# EAGLE design INS_iter5 (EAGLE 9.4.2)
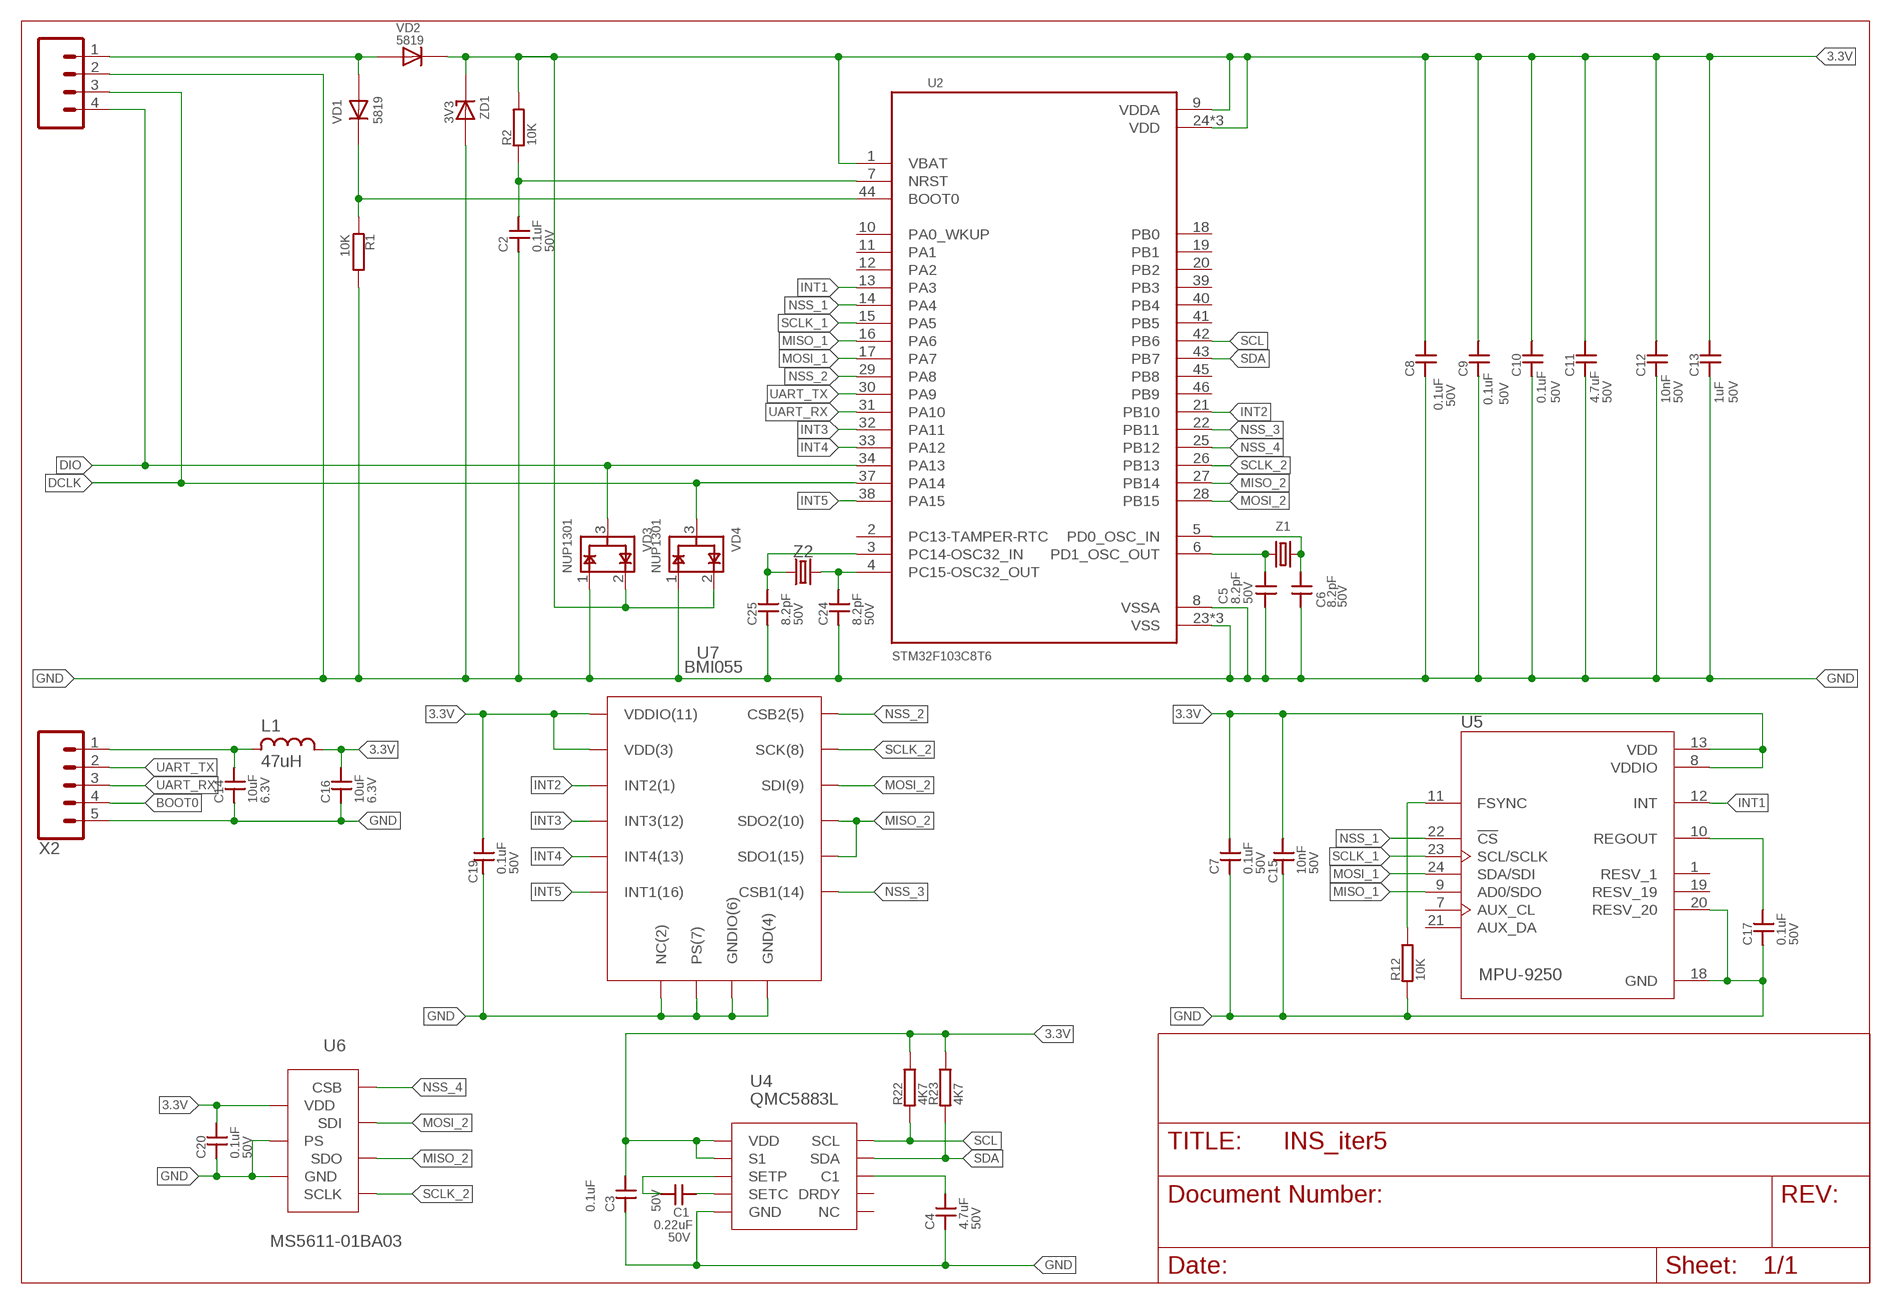
[diagram p0: schematic, sheet 1]

## Parts
C1  0.22uF  C0402  [0402]
C2  0.1uF  C0402  [0402]
C3  0.1uF  C0402  [0402]
C4  4.7uF  C0402  [0402]
C5  8.2pF  C0402  [0402]
C6  8.2pF  C0402  [0402]
C7  0.1uF  C0402  [0402]
C8  0.1uF  C0402  [0402]
C9  0.1uF  C0402  [0402]
C10  0.1uF  C0402  [0402]
C11  4.7uF  C0402  [0402]
C12  10nF  C0402  [0402]
C13  1uF  C0402  [0402]
C14  10uF  C0402  [0402]
C15  10nF  C0402  [0402]
C16  10uF  C0402  [0402]
C17  0.1uF  C0402  [0402]
C19  0.1uF  C0402  [0402]
C20  0.1uF  C0402  [0402]
C24  8.2pF  C0402  [0402]
C25  8.2pF  C0402  [0402]
L1  47uH  L0603_SMALL  [0603_SMALL]
R1  10K  R0402  [0402]
R2  10K  R0402  [0402]
R12  10K  R0402  [0402]
R22  4K7  R0402  [0402]
R23  4K7  R0402  [0402]
U2  STM32F103C8T6  [QFP50P900X900X160-48N]
U4  QMC5883L  [QFN16(3X3)NOPAD]
U5  MPU-9250  [QFN40P300X300X105-24N]
U6  MS5611-01BA03  [QFN5X3]
U7  BMI055  [LGA16PIN]
VD1  5819  DIODE0402  [0402]
VD2  5819  DIODE0402  [0402]
VD3  NUP1301  ESD_PROTECTIONSOT123  [SOT23]
VD4  NUP1301  ESD_PROTECTIONSOT123  [SOT23]
X1  1X4DUPON  1X4DUPON_2MM  [1X04DUPON_2MM]
X2  1X5FFC5-1MM  [FFC-1MM_5]
Z1  8MHz  CRYSTAL4FOOT  [CRYSTAL-SMD-3.2X2.5MM]
Z2  CRYSTAL2FOOT  [CRYSTAL-SMD-3.2X1.5X90MM]
ZD1  3V3  ZENER-DIODES  [SOD-323]

## Nets
3.3V: C3.2 C7.2 C8.2 C9.2 C10.2 C11.2 C12.2 C13.2 C15.2 C16.2 C19.2 C20.2 L1.P$2 R2.2 R22.2 R23.2 U2.1(VBAT) U2.9(VDDA) U2.24(VDD) U2.36(VDD) U2.48(VDD) U4.2(VDD) U4.4(S1) U4.13(VDD) U5.8(VDDIO) U5.13(VDD) U6.P$4(VDD) U7.P$3(VDD(3)) U7.P$11(VDDIO(11)) VD2.1(C) VD3.2(VCC) VD4.2(VCC) ZD1.2(C)
3.3V_S: VD1.2(A) VD2.2(A) X1.1
BOOT0: R1.1 U2.44(BOOT0) VD1.1(C) X2.4
DCLK: U2.37(PA14) VD4.3(I/O) X1.3
DIO: U2.34(PA13) VD3.3(I/O) X1.4
GND: C2.1 C3.1 C4.1 C5.1 C6.1 C7.1 C8.1 C9.1 C10.1 C11.1 C12.1 C13.1 C14.1 C15.1 C16.1 C17.1 C19.1 C20.1 C24.1 C25.1 R1.2 R12.1 U2.8(VSSA) U2.23(VSS) U2.35(VSS) U2.47(VSS) U4.9(GND) U4.11(GND) U5.18(GND) U5.20(RESV_20) U6.P$2(GND) U6.P$3(PS) U7.P$2(NC(2)) U7.P$4(GND(4)) U7.P$6(GNDIO(6)) U7.P$7(PS(7)) VD3.1(GND) VD4.1(GND) X1.2 X2.5 ZD1.1(A)
INT1: U2.13(PA3) U5.12(INT)
INT2: U2.21(PB10) U7.P$1(INT2(1))
INT3: U2.32(PA11) U7.P$12(INT3(12))
INT4: U2.33(PA12) U7.P$13(INT4(13))
INT5: U2.38(PA15) U7.P$16(INT1(16))
MISO_1: U2.16(PA6) U5.9(AD0/SDO)
MISO_2: U2.27(PB14) U6.P$7(SDO) U7.P$10(SDO2(10)) U7.P$15(SDO1(15))
MOSI_1: U2.17(PA7) U5.24(SDA/SDI)
MOSI_2: U2.28(PB15) U6.P$6(SDI) U7.P$9(SDI(9))
N$2: C25.2 U2.3(PC14-OSC32_IN) Z2.P$1
N$3: C2.2 R2.1 U2.7(NRST)
N$4: C24.2 U2.4(PC15-OSC32_OUT) Z2.P$2
N$5: C17.2 U5.10(REGOUT)
N$6: R12.2 U5.11(FSYNC)
N$9: C14.2 L1.P$1 X2.1
N$16: C5.2 U2.6(PD1_OSC_OUT) Z1.1
N$17: C6.2 U2.5(PD0_OSC_IN) Z1.3
N$22: C1.2 U4.12(SETC)
N$25: C1.1 U4.8(SETP)
N$28: C4.2 U4.10(C1)
NSS_1: U2.14(PA4) U5.22(!CS)
NSS_2: U2.29(PA8) U7.P$5(CSB2(5))
NSS_3: U2.22(PB11) U7.P$14(CSB1(14))
NSS_4: U2.25(PB12) U6.P$1(CSB) U6.P$8(CSB)
SCL: R22.1 U2.42(PB6) U4.1(SCL)
SCLK_1: U2.15(PA5) U5.23(SCL/SCLK)
SCLK_2: U2.26(PB13) U6.P$5(SCLK) U7.P$8(SCK(8))
SDA: R23.1 U2.43(PB7) U4.16(SDA)
UART_RX: U2.31(PA10) X2.3
UART_TX: U2.30(PA9) X2.2
Unconnected: U2.2(PC13-TAMPER-RTC) U2.10(PA0_WKUP) U2.11(PA1) U2.12(PA2) U2.18(PB0) U2.19(PB1) U2.20(PB2) U2.39(PB3) U2.40(PB4) U2.41(PB5) U2.45(PB8) U2.46(PB9) U4.3(NC) U4.5(NC) U4.6(NC) U4.7(NC) U4.14(NC) U4.15(DRDY) U5.1(RESV_1) U5.7(AUX_CL) U5.19(RESV_19) U5.21(AUX_DA)

## Library data of the parts
C1-C13 C15 C17 C19 C20 C24 C25 = LARS_409_R,C,L:C; VOLTAGE: 50V
C14 C16 = LARS_409_R,C,L:C; VOLTAGE: 6.3V
L1 = LARS_409_R,C,L:L
R1 R2 R12 R22 R23 = LARS_409_R,C,L:R
U2 = LARS_409_MK:STM32F103C8T6
U4 = LARS_409_MC:QMC5883L
U5 = LARS_409_SENSORS:MPU-9250: Axis=3 Axis Gyro+3 Axis Accel+Compass. Pin For Pin With m Check prices <https://pricing.snapeda.com/parts/MPU-9250/TDK%20InvenSense/view-part?ref=eda>; AVAILABILITY: Bad; DESCRIPTION: Accelerometer, Gyroscope, Magnetometer, 9 Axis Sensor I²C, SPI Output; MF: TDK InvenSense; MP: MPU-9250; PACKAGE: TFQFN-24 TDK InvenSense; PRICE: None
U6 = LARS_409_SENSORS:MS5611-01BA03
U7 = LARS_409_SENSORS:BMI055
VD1 VD2 = LARS_409_DIODE:DIODE
VD3 VD4 = LARS_409_DIODE:ESD_PROTECTION
X1 = LARS_409_CONNECTORS:1X4
X2 = LARS_409_CONNECTORS:1X5
Z1 Z2 = LARS_409_CLOCKS:CRYSTAL
ZD1 = LARS_409_DIODE:ZENER-DIODES

## Board
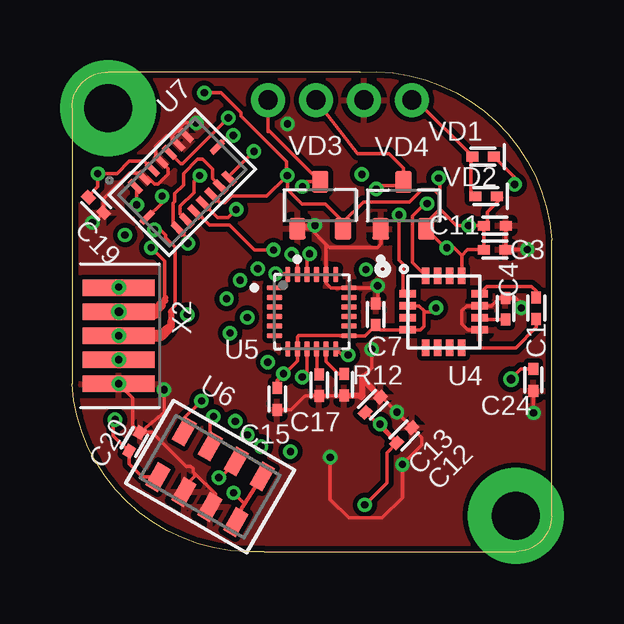
[diagram p1: board, top side]
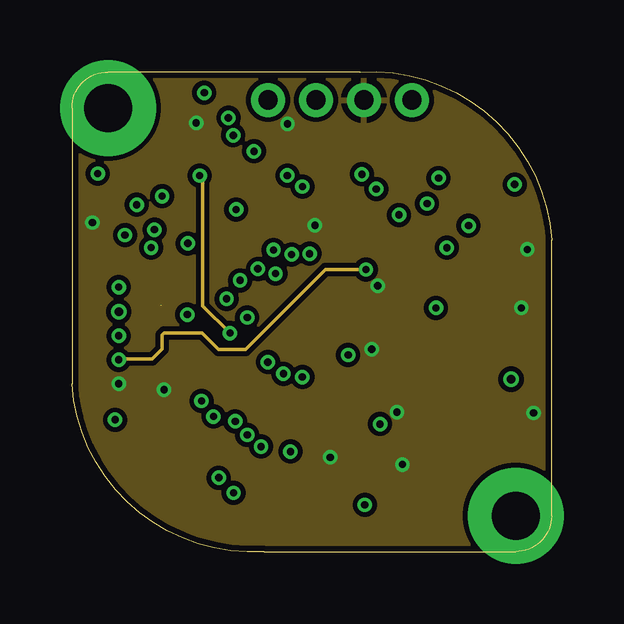
[diagram p2: board, inner layer Route2]
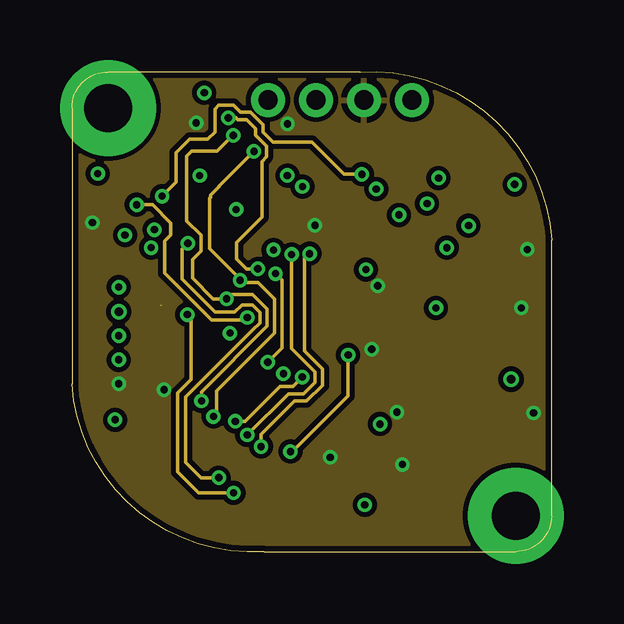
[diagram p3: board, inner layer Route15]
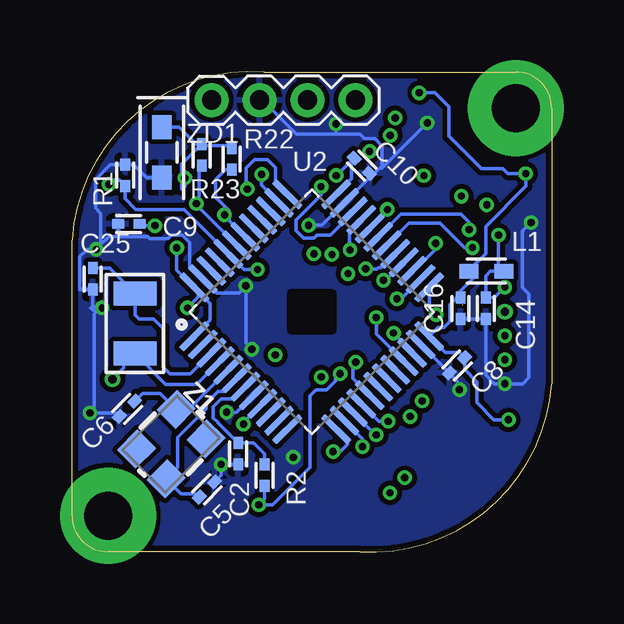
[diagram p4: board, bottom side, seen from below]

Size 20 x 20.03 mm. Coordinates in mm from the lower left corner, seen from the top.
Outline: 8,0.01 18.5,0.01 arc90 20,1.51 20,13.01 arc90 12,20.01 1.5,20.01 arc90 0,18.51 0,7.01 arc90 8,0.01
Copper layers (1*2*15*16): Top 0.035mm / dielectric 1.6mm / Route2 0.035mm / dielectric 0.15mm / Route15 0.035mm / dielectric 0.2mm / Bottom 0.035mm
Design rules "pcbWAY4layers": minimum track width 6mil, minimum drill 0.3mm, track to track 6mil, track to pad 6mil, pad to pad 6mil, via to via 6mil, smd to smd 0mil, copper to edge 0.25mm, drill to drill 0.25mm, minimum pad ring 0.15mm, minimum via ring 0.15mm, stop-mask expansion 2mil, vias tented up to drill 3mm, thermal gap 10mil

### Footprints (pad centres in the part's own frame; a part is rotated, then mirrored left to right if it is on the bottom)
0402 = smd 0.5 x 0.4: 1 -0.45,0; 2 0.45,0
0603_SMALL = smd 0.8 x 0.6: P$1 -0.727,0; P$2 0.727,0
QFP50P900X900X160-48N = smd 1.56 x 0.28: 1 -4.18,2.75; 2 -4.18,2.25; 3 -4.18,1.75; 4 -4.18,1.25; 5 -4.18,0.75; 6 -4.18,0.25; 7 -4.18,-0.25; 8 -4.18,-0.75; 9 -4.18,-1.25; 10 -4.18,-1.75; 11 -4.18,-2.25; 12 -4.18,-2.75; 25 4.18,-2.75; 26 4.18,-2.25; 27 4.18,-1.75; 28 4.18,-1.25; 29 4.18,-0.75; 30 4.18,-0.25; 31 4.18,0.25; 32 4.18,0.75; 33 4.18,1.25; 34 4.18,1.75; 35 4.18,2.25; 36 4.18,2.75 | smd 0.28 x 1.56: 13 -2.75,-4.18; 14 -2.25,-4.18; 15 -1.75,-4.18; 16 -1.25,-4.18; 17 -0.75,-4.18; 18 -0.25,-4.18; 19 0.25,-4.18; 20 0.75,-4.18; 21 1.25,-4.18; 22 1.75,-4.18; 23 2.25,-4.18; 24 2.75,-4.18; 37 2.75,4.18; 38 2.25,4.18; 39 1.75,4.18; 40 1.25,4.18; 41 0.75,4.18; 42 0.25,4.18; 43 -0.25,4.18; 44 -0.75,4.18; 45 -1.25,4.18; 46 -1.75,4.18; 47 -2.25,4.18; 48 -2.75,4.18
QFN16(3X3)NOPAD = smd 0.7 x 0.3: 1 -1.5,0.75; 2 -1.5,0.25; 3 -1.5,-0.25; 4 -1.5,-0.75; 9 1.5,-0.75; 10 1.5,-0.25; 11 1.5,0.25; 12 1.5,0.75 | smd 0.3 x 0.7: 5 -0.75,-1.5; 6 -0.25,-1.5; 7 0.25,-1.5; 8 0.75,-1.5; 13 0.75,1.5; 14 0.25,1.5; 15 -0.25,1.5; 16 -0.75,1.5
QFN40P300X300X105-24N = smd 0.64 x 0.22: 1 -1.545,1; 2 -1.545,0.6; 3 -1.545,0.2; 4 -1.545,-0.2; 5 -1.545,-0.6; 6 -1.545,-1; 13 1.545,-1; 14 1.545,-0.6; 15 1.545,-0.2; 16 1.545,0.2; 17 1.545,0.6; 18 1.545,1 | smd 0.22 x 0.64: 7 -1,-1.545; 8 -0.6,-1.545; 9 -0.2,-1.545; 10 0.2,-1.545; 11 0.6,-1.545; 12 1,-1.545; 19 1,1.545; 20 0.6,1.545; 21 0.2,1.545; 22 -0.2,1.545; 23 -0.6,1.545; 24 -1,1.545
QFN5X3 = smd 1.1 x 0.6: P$1 -1.1,-1.875; P$2 -1.1,-0.625; P$3 -1.1,0.625; P$4 -1.1,1.875; P$5 1.1,1.875; P$6 1.1,0.625; P$7 1.1,-0.625; P$8 1.1,-1.875
LGA16PIN = smd 0.675 x 0.25: P$1 -1.262,-1.5; P$2 -1.262,-1; P$3 -1.262,-0.5; P$4 -1.262,0; P$5 -1.262,0.5; P$6 -1.262,1; P$7 -1.262,1.5; P$9 1.262,1.5; P$10 1.262,1; P$11 1.262,0.5; P$12 1.262,0; P$13 1.262,-0.5; P$14 1.262,-1; P$15 1.262,-1.5 | smd 0.25 x 0.675: P$8 0,2.072; P$16 0,-2.072
SOT23 = smd 0.7 x 0.9: 1 -0.95,-0.98; 2 0.95,-0.98; 3 0,0.98
1X04DUPON_2MM = drill 0.8 pad 1.422: 1 0,0; 2 2,0; 3 4,0; 4 6,0
FFC-1MM_5 = smd 0.7 x 3: 1 -2,0; 2 -1,0; 3 0,0; 4 1,0; 5 2,0
CRYSTAL-SMD-3.2X2.5MM = smd 1.2 x 1.1: 1 -1.159,-0.843; 2 1.191,-0.843; 3 1.191,0.907; 4 -1.159,0.907
CRYSTAL-SMD-3.2X1.5X90MM = smd 1 x 1.8: P$1 -1.25,0; P$2 1.25,0
SOD-323 = smd 1 x 0.8: 1 -1.062,0; 2 1.042,0

### Placement (x,y rotation side)
C1  19.36,10.16 90 top
C2  13.07,4.1 90 bottom
C3  17.63,12.6 180 top
C4  18.08,10.14 270 top
C5  14.37,2.6 225 bottom
C6  17.7,5.97 45 bottom
C7  12.67,9.91 270 top
C8  3.94,7.78 45 bottom
C9  17.63,13.67 0 bottom
C10  7.92,16.1 135 bottom
C11  17.64,13.6 180 top
C12  13.86,4.86 225 top
C13  12.55,6.14 225 top
C14  2.74,10.15 90 bottom
C15  8.56,6.38 90 top
C16  3.8,10.15 90 bottom
C17  10.31,6.96 90 top
C19  1.01,14.46 135 top
C20  2.61,4.59 240 top
C24  19.24,7.17 90 top
C25  19.13,11.38 90 bottom
L1  2.72,11.7 180 bottom
R1  17.78,15.71 90 bottom
R2  11.97,3.2 270 bottom
R12  11.35,6.98 90 top
R22  13.34,16.38 90 bottom
R23  14.59,16.55 90 bottom
U2  10,10.01 45 bottom
U4  15.5,10.01 0 top
U5  10,10.01 0 top
U6  5.76,3.13 60 top
U7  4.6,15.41 315 top
VD1  17.14,16.48 180 top
VD2  17.27,14.83 180 top
VD3  10.35,14.45 0 top
VD4  13.82,14.44 0 top
X1  14.18,18.84 0 bottom
X2  1.95,9.01 270 top
Z1  15.85,4.46 45 bottom
Z2  17.37,9.52 270 bottom
ZD1  16.25,16.67 90 bottom

### Tracks (layer width: path | path; a pad name or v marks a point on that pad's centre or on a via)
3.3V  (via drill 0.3)
  Top 0.152: U4.13 16.25,12.36 | 16.25,12.36 16.49,12.6 C3.2 C11.2 | 14.67,10.01 14.67,9.39 14.54,9.26 U4.4 12.86,9.26 C7.2 12.23,9.01 U5.13 11.19,9.01 11.19,9.02 9.45,9.02 9.4,8.96 U5.8 9.4,7.96 8.56,7.12 C15.2 8.56,7.16 v8.82,7.42 v8.82,7.43 | 14.67,10.01 14.67,10.06 14.47,10.26 U4.2 | U6.P$4 2.92,3.12 2.38,3.67 C20.2 1.72,4.84 1.72,5.43 v1.8,5.51 | 16.25,12.36 15.93,12.68 v15.63,12.68 15.55,12.68 VD4.2 14.78,13.74 15.34,14.31 | C12.2 12.27,5.82 C13.2 | 14.67,10.01 15.02,10.01 v15.18,10.17 | C12.2 13.13,4.14 13.13,2.88 v12.21,1.96 | C19.2 0.69,14.83 1.08,15.22 v1.08,15.77 1.88,15.77 2.4,16.29 3.02,16.29 U7.P$3 | v12.85,5.33 13.54,4.64 C12.2 | 11.3,13.74 11.3,13.77 10.58,14.49 9.6,14.49 8.98,15.11 v8.98,15.69 8.95,15.66 | 11.3,13.74 VD3.2 | 11.3,13.74 12.15,14.59 14.07,14.59 14.59,15.11 15.09,15.11 15.34,14.86 | 15.34,14.31 15.34,14.86 | v15.29,15.59 15.34,15.54 15.34,14.86 | C11.2 v16.54,13.6 16.04,13.6 15.34,14.31 | C11.2 17.32,13.74 17.32,14.17 17.92,14.78 VD2.1 | U7.P$11 6.16,14.56 6.38,14.56 6.66,14.84 8.12,14.84 8.95,15.66 | v5.52,19.14 6.23,19.14 7.05,18.32 7.05,18.16 8.95,16.27 8.95,15.66
  Bottom 0.152: R23.2 14.53,16.94 13.45,16.94 R22.2 | v15.63,12.68 15.63,11.76 U2.48 14.73,10.86 | U2.36 8.34,15.56 8.34,16.32 C10.2 8.96,15.69 v8.98,15.69 | U2.1 14.23,9.67 14.23,10.36 14.73,10.86 | v15.18,10.17 14.73,10.62 14.73,10.86 | R2.2 11.97,2.2 v12.21,1.96 11.63,1.96 10.07,3.52 10.07,6.51 9.81,6.76 9.38,6.76 9.02,7.12 9.02,7.36 8.95,7.43 v8.82,7.43 | U2.9 12.85,5.4 v12.85,5.33 | R23.2 15.42,16.16 15.42,15.12 15.29,15.26 v15.29,15.59 | R23.2 14.83,17 15.54,17.71 ZD1.2 | C9.2 17.11,13.6 v16.54,13.6 | v1.8,5.51 2.4,5.51 3.11,6.22 3.11,7.09 3.62,7.61 C8.2 3.85,8.32 4.42,8.32 U2.24 4.74,9.37 4.49,9.37 4.24,9.62 4.24,10.31 3.95,10.6 C16.2 3.8,10.87 3.21,11.47 L1.P$2 3.45,11.74 2.75,12.44 2.75,13.58 1.08,15.24 v1.08,15.77 1.82,15.77 2.03,15.99 2.92,15.99 4.27,17.34 4.27,18.56 4.86,19.14 v5.52,19.14
3.3V_S
  Top 0.152: X1.1 14.34,18.84 VD1.2 16.64,16.43 16.64,15.01 VD2.2
BOOT0  (via drill 0.3)
  Top 0.152: VD1.1 18.46,15.61 v18.46,15.32
  Route2 0.152: v12.26,11.77 10.58,11.77 7.24,8.43 6.12,8.43 5.43,9.12 3.84,9.12 3.77,9.05 3.77,8.46 3.35,8.04 1.98,8.04 X2.4
  Bottom 0.152: v12.26,11.77 12.82,11.77 U2.44 15.33,14.28 17.34,14.28 17.78,14.72 R1.1 18.02,15.49 18.29,15.49 v18.46,15.32
  other vias: 1.95,8.01
DCLK  (via drill 0.3)
  Top 0.152: X1.3 11.91,16.61 13.21,16.61 13.82,16 VD4.3 13.68,15.27 12.83,15.27 v12.69,15.13
  Bottom 0.152: v12.69,15.13 12.69,15.41 12.74,15.36 12.74,16 12.39,16.35 11.84,16.35 11.51,16.02 11.51,15.41 U2.37
DIO  (via drill 0.3)
  Top 0.152: X1.4 8.18,17.53 8.21,17.58 VD3.3 9.81,15.43 v9.61,15.23
  Bottom 0.152: U2.34 8.28,14.17 9.23,13.22 9.78,13.22 9.91,13.09 10.35,13.09 10.66,13.4 10.66,13.84 9.61,14.89 v9.61,15.23
GND  (via drill 0.3)
  Top 0.152: C7.1 12.75,10.44 v12.75,11.09 12.67,11.01 U5.18 10.81,11.01 10.6,11.22 U5.20 10.6,12.82 | U4.9 16.5,9.26 16.27,9.49 16.27,10.07 16.46,10.26 U4.11 17.49,10.26 17.82,10.59 C4.1 18.52,10.59 18.74,10.37 v18.74,10.17 | 10.6,12.82 9.95,13.47 VD3.1 9.55,13.62 v10.13,13.62 | v3.84,6.76 3.84,5.81 C20.1 | C20.1 2.54,5.28 2.54,6.42 X2.5 | 12.87,6.56 C13.1 12.92,6.46 v13.55,5.83 13.55,5.81 C12.1 14.6,4.76 14.6,4.47 v13.78,3.65 13.78,2.26 12.93,1.41 11.55,1.41 10.77,2.19 v10.77,3.94 | 11.38,6.56 R12.1 11.33,6.51 C17.1 9.72,6.51 9.14,5.93 C15.1 | v0.85,13.73 0.91,13.73 C19.1 1.32,14.73 2.4,15.8 2.8,15.8 U7.P$2 3.19,15.6 3.45,15.34 3.58,15.34 4.01,15.76 4.01,15.99 U7.P$4 3.49,16.52 3.49,16.91 3.94,17.36 4.18,17.36 | 10.6,12.82 10.74,12.68 12.73,12.68 12.88,12.83 VD4.1 | C11.1 C3.1 18.09,12.61 v18.99,12.61 | 12.12,7.3 12.5,7.68 v12.5,8.45 | C20.1 3.34,4.98 4.75,3.57 4.95,3.57 5.05,3.47 5.05,3.34 | U6.P$3 4.67,2.7 5.12,3.16 5.12,3.27 5.98,2.41 5.98,2.1 U6.P$2 | U7.P$6 4.18,17.25 4.18,17.36 | 4.18,17.36 4.37,17.55 | U7.P$7 4.58,17.55 4.37,17.55 | 4.37,17.55 4.71,17.89 v5.18,17.89 | C24.1 v19.24,5.8 v19.25,5.79
  Top 0.254: R12.1 11.99,6.53 12.06,6.45 12.12,6.52 12.12,7.08 | 12.12,7.08 12.12,7.3 | C13.1 12.24,7.08 12.12,7.08
  Bottom 0.152: C2.1 v13.78,3.65 13.78,3.2 C5.1 | U2.23 C8.1 4.09,7.29 4.09,7.26 3.84,7.01 v3.84,6.76 | C16.1 C14.1 2.74,7.37 2.38,7.01 X2.5 1.2,7.01 0.94,7.27 0.94,10.75 1.21,11.02 1.21,13.37 v0.85,13.73 | U2.8 13.03,5.92 13.05,5.92 13.14,5.83 v13.55,5.83 | C6.1 18.16,5.79 v19.25,5.79 19.07,5.97 19.07,9.91 18.81,10.17 | v18.74,10.17 18.81,10.17 | 18.81,10.17 19.22,10.17 19.14,10.09 18.95,10.09 19.13,10.27 C25.1 19.67,10.93 19.67,12.31 19.37,12.61 v18.99,12.61 18.8,12.81 | v12.5,8.45 12.75,8.7 v12.75,11.09 13.04,10.8 13.97,10.8 U2.47 15.1,11.93 15.1,12.9 15.41,13.21 15.85,13.21 15.99,13.08 16.76,13.08 16.84,13.15 18.19,13.15 | 18.8,12.81 18.45,13.15 18.19,13.15 | 7.08,16.09 7.38,15.79 C10.1 7.6,15.6 U2.35 9.58,13.62 v10.13,13.62 | v5.18,17.89 7.08,16 7.08,16.09 | X1.2 12.11,18.89 10.64,17.42 9,17.42 | 9,17.42 7.99,17.42 7.8,17.23 7.37,17.23 7.06,16.92 7.06,16.48 7.08,16.47 7.08,16.09 | 18.19,13.15 18.08,13.27 C9.1 | 18.8,12.81 18.8,14.11 19.02,14.33 19.02,15.53 18.4,16.16 R1.2 17.43,16.16 16.88,15.61 ZD1.1 | 9,17.42 8.99,17.43 v8.99,17.84
  other vias: 1.95,7.01
  pour Top (isolate 0.2): -1,-0.99 21,-0.99 21,21.01 -1,21.01
  pour Route2 (isolate 0.2): -2,-1.99 22,-1.99 22,2.01 22,22.01 18,22.01 -2,22.01
  pour Route15 (isolate 0.2): -3,-2.99 23,-2.99 23,1.01 23,23.01 17,23.01 -3,23.01
  pour Bottom (isolate 0.2): -4,-3.99 24,-3.99 24,1.01 24,24.01 19,24.01 -4,24.01
INT1  (via drill 0.3)
  Top 0.152: U5.12 11.26,8.21 v11.52,8.21
  Route15 0.152: v11.52,8.21 11.52,6.51 9.19,4.18 v9.11,4.18
  Bottom 0.152: U2.13 8.51,4.63 8.51,4.49 8.81,4.18 v9.11,4.18
INT2  (via drill 0.3)
  Top 0.152: v2.7,14.47 2.7,15.19 U7.P$1
  Route15 0.152: v7.31,9.77 7.21,9.67 5.82,9.67 3.86,11.63 3.86,12.96 4.12,13.22 4.12,13.71 3.36,14.47 v2.7,14.47
  Bottom 0.152: U2.21 7.31,9.09 v7.31,9.77
INT3  (via drill 0.3)
  Top 0.152: U7.P$12 6.08,13.94 6.51,13.94 v6.85,14.28
  Bottom 0.152: U2.32 6.84,14.24 v6.84,14.27 v6.85,14.28
INT4  (via drill 0.3)
  Top 0.152: v8.41,12.59 7.61,12.59 6.57,13.63 5.73,13.63 5.2,14.17 U7.P$13
  Bottom 0.152: v8.41,12.59 8.41,12.91 8.43,12.92 8.43,13.36 U2.33
INT5  (via drill 0.3)
  Top 0.152: v3.76,14.83 3.75,14.54 U7.P$16
  Route15 0.152: v3.76,14.83 4.35,15.42 4.35,16.65 4.9,17.2 5.65,17.2 5.96,17.51 5.96,18.46 6.12,18.63 6.74,18.63 7.04,18.33 7.45,18.33 7.96,17.82 7.96,17.51 8.39,17.08 10,17.08 11.34,15.74 v12.09,15.74
  Bottom 0.152: v12.09,15.74 12.09,15.29 U2.38
MISO_1  (via drill 0.3)
  Top 0.152: U5.9 9.8,7.48 v9.61,7.29
  Route15 0.152: v6.81,5.44 7.22,5.44 8.67,6.9 9.21,6.9 v9.61,7.29
  Bottom 0.152: U2.16 7.2,5.44 v6.81,5.44
MISO_2  (via drill 0.3)
  Top 0.152: v4.83,12.87 4.78,12.92 4.78,13.11 U7.P$15 4.21,13.68 4.21,14.54 4.29,14.62 4.29,14.93 4.65,15.29 4.65,15.78 5.24,16.37 5.45,16.37 5.86,15.97 5.86,15.57 U7.P$10 | U6.P$7 6.17,3.09 v6.12,3.09
  Route15 0.152: v6.12,3.09 5.38,3.09 4.74,3.74 4.74,6.46 7.52,9.25 7.53,9.25 7.84,9.56 7.84,9.99 7.53,10.3 7.09,10.3 6.79,10 5.98,10 4.59,11.38 4.59,12.62 v4.83,12.87
  Bottom 0.152: U2.27 5.73,11.73 4.74,12.72 4.74,12.77 v4.83,12.87
MOSI_1  (via drill 0.3)
  Top 0.152: v8.49,11.6 8.96,11.6 U5.24
  Route15 0.152: v8.49,11.6 8.75,11.34 8.75,8.5 v8.17,7.91
  Bottom 0.152: U2.17 8.28,7.23 8.28,7.8 v8.17,7.91
MOSI_2  (via drill 0.3)
  Top 0.152: U7.P$9 6.55,15.67 v7.59,16.7 | U6.P$6 5.77,5.51 v5.9,5.64
  Route15 0.152: v5.9,5.64 6.03,5.77 6.03,6.71 8.45,9.13 8.45,10.54 7.75,11.23 7.1,11.23 v7.01,11.32 7.01,11.38 5.74,12.65 5.74,14.75 5.77,14.78 5.77,14.88 5.81,14.92 5.83,14.92 6.14,15.23 6.14,15.25 v7.59,16.7
  Bottom 0.152: v7.01,11.32 6.92,11.32 U2.28
N$1  (via drill 2 pad 4)
  other vias: 1.5,18.51
N$2
  Bottom 0.152: U2.3 15.07,7.41 15.9,7.41 16.2,7.71 16.2,9.31 16.6,9.71 17.2,9.71 17.37,9.88 Z2.P$1 18.43,11.83 C25.2
N$3
  Bottom 0.152: R2.1 11.97,4.08 12.43,4.55 C2.2 13.9,5.38 13.9,5.39 14.11,5.6 14.11,6.06 13.78,6.38 13.28,6.38 U2.7
N$4  (via drill 0.35)
  Top 0.152: C24.2 18.73,7.63 v18.3,7.21 v18.31,7.2
  Bottom 0.152: U2.4 14.79,6.99 16.09,6.99 Z2.P$2 17.49,8.15 17.85,8.15 17.85,7.66 v18.31,7.2
N$5
  Top 0.152: U5.10 10.21,8.46 10.21,7.51 C17.2
N$6
  Top 0.152: R12.2 11.12,7.43 10.6,7.94 U5.11
N$8  (via drill 2 pad 4)
  other vias: 18.5,1.51
N$9  (via drill 0.3)
  Top 0.152: v1.95,11.04 X2.1
  Bottom 0.152: v2.21,13.21 2.21,11.92 L1.P$1 2.55,11.7 2.74,11.51 C14.2 2.39,10.6 v1.95,11.04
N$16
  Bottom 0.152: C5.2 14.82,2.41 15.44,2.41 Z1.1 15.6,3.52 15.6,4.77 14.41,5.96 14.41,6.18 13.91,6.68 13.68,6.68 U2.6
N$17
  Bottom 0.152: C6.2 17.05,6.61 16.32,6.61 Z1.3 15.13,5.95 U2.5
N$22
  Top 0.152: U4.12 17.31,11.07 19.16,11.07 19.36,10.87 C1.2
N$25
  Top 0.152: C1.1 19.36,9.37 18.5,8.51 U4.8
N$28
  Top 0.152: C4.2 17.07,9.69 U4.10
NSS_1  (via drill 0.3)
  Top 0.152: v9.91,12.43 9.8,12.32 U5.22
  Route15 0.152: v7.88,4.39 7.88,4.9 9.28,6.29 9.78,6.29 10.44,6.95 10.44,7.64 9.7,8.37 9.7,12.22 v9.91,12.43
  Bottom 0.152: U2.14 7.88,4.72 v7.88,4.39
NSS_2  (via drill 0.3)
  Top 0.152: U7.P$5 4.53,16.19 4.62,16.19 v6.52,18.1
  Route15 0.152: v7.75,11.8 7.28,11.8 6.87,12.21 6.87,12.9 7.92,13.95 7.92,16.28 8.12,16.48 8.12,16.92 7.66,17.39 7.66,17.65 7.28,18.03 6.91,18.03 6.84,18.1 v6.52,18.1
  Bottom 0.152: U2.29 7.1,11.85 7.23,11.85 7.28,11.8 v7.75,11.8
NSS_3  (via drill 0.3)
  Top 0.152: v5.33,15.69 5.09,15.45 5.09,14.98 4.52,14.42 4.52,14.08 U7.P$14
  Route2 0.152: v5.33,15.69 5.46,15.56 5.46,10.26 v6.59,9.12
  Bottom 0.152: U2.22 5.81,8.34 v6.59,9.12
NSS_4  (via drill 0.3)
  Top 0.152: U6.P$1 6.74,1.29 7.2,2 | U6.P$8 7.2,2 | 7.2,2 v6.74,2.46
  Route15 0.152: v4.81,9.89 4.96,9.74 4.96,7.18 4.4,6.62 4.4,3.34 5.28,2.46 v6.74,2.46
  Bottom 0.152: U2.25 5.1,10.18 v4.81,9.89
SCL  (via drill 0.3)
  Top 0.152: U4.1 13.8,10.96 13.8,12.01 13.64,12.17 v13.64,14.05
  Bottom 0.152: R22.1 13.6,15.93 14,15.53 14,14.78 13.81,14.58 13.79,14.58 13.44,14.23 | 13.44,14.23 13.44,13.81 U2.42 | v13.64,14.05 13.62,14.05 13.44,14.23
SCLK_1  (via drill 0.3)
  Top 0.152: v9.16,12.4 9.28,12.29 9.29,12.29 9.4,12.18 U5.23
  Route15 0.152: v7.31,4.88 9.02,6.59 9.66,6.59 10.14,7.07 10.14,7.51 9.16,8.49 v9.16,12.4
  Bottom 0.152: U2.15 7.34,4.88 v7.31,4.88
SCLK_2  (via drill 0.3)
  Top 0.152: U6.P$5 4.69,5.58 v5.4,6.29 | U7.P$8 6.55,17.37 v6.72,17.37
  Route15 0.152: v5.4,6.29 5.4,6.67 8.14,9.42 8.14,10.13 7.54,10.73 6.63,10.73 v6.45,10.55 5.89,10.55 5.02,11.42 5.02,12.19 5.38,12.55 5.38,13.21 4.79,13.8 4.79,16.5 4.99,16.7 6.06,16.7 v6.72,17.37
  Bottom 0.152: v6.45,10.55 6.28,10.55 U2.26
SDA  (via drill 0.3)
  Top 0.152: U4.16 14.19,12.07 14.19,14 14.71,14.52 v14.81,14.52
  Bottom 0.152: R23.1 14.7,15.99 14.7,14.63 v14.81,14.52 14.81,14.47 U2.43
UART_RX  (via drill 0.3)
  Top 0.152: 3.73,9.01 3.59,9.01 | 4.13,10.01 4.13,10.11 4.3,10.28 4.3,12.71 3.91,13.1 3.91,13.21 3.68,13.44 v3.44,13.44
  Top 0.254: 4.13,10.01 4.13,9.6
  Top 0.305: 4,9.28 4.13,9.42 4.13,9.6
  Top 0.406: 4,9.28 3.73,9.01
  Top 0.508: 3.59,9.01 X2.3
  Bottom 0.152: U2.31 6.27,14.09 3.79,14.09 3.44,13.75 v3.44,13.44
  other vias: 1.95,9.01
UART_TX  (via drill 0.3, 0.35)  (1 unrouted)
  Top 0.152: 3.89,10.59 3.86,10.62 3.86,12.13 v3.3,12.69
  Top 0.254: 3.71,10.3 3.89,10.47 3.89,10.59
  Top 0.406: 3.43,10.01 3.7,10.28 3.7,10.29 3.71,10.3
  Top 0.61: X2.2 3.43,10.01
  Bottom 0.152: U2.30 5.96,13.7 4.66,13.7 3.64,12.69 v3.3,12.69
  other vias: 1.95,10.01